# Altium schematic sheet ButtonFiltr.SchDoc
size A3
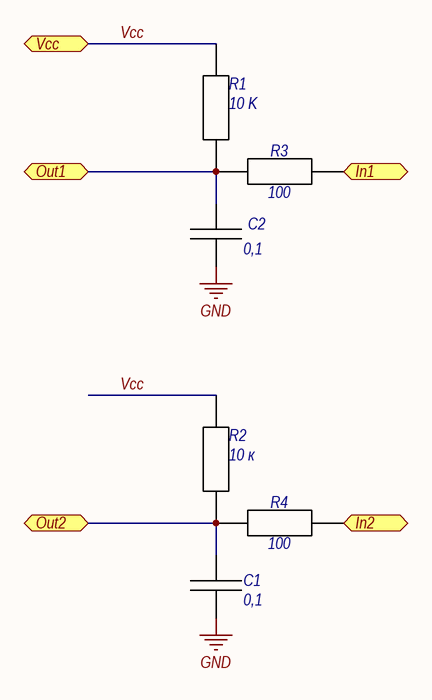
[diagram p0: ButtonFiltr.SchDoc]

## Parts
C1  Value Sch: 0,1  [C0603_autoMount]  (hidden comment: Конденсаторы керамические)
C2  Value Sch: 0,1  [C0603_autoMount]  (hidden comment: Конденсаторы керамические)
R1  Value Euro: 10 K  [R0603_autoMount]  (hidden comment: Resistor)
R2  Value Sсh: 10 к  [R0603_autoMount]  (hidden comment: Resistor)
R3  Value Sсh: 100  [R0603_autoMount]  (hidden comment: Resistor)
R4  Value Sсh: 100  [R0603_autoMount]  (hidden comment: Resistor)

## Ports
In1, In2, Out1, Out2, Vcc

## Nets
GND: C1.1 C2.1
In1: R3.1 ; port In1
In2: R4.1 ; port In2
Out1: C2.2 R1.2 R3.2 ; port Out1
Out2: C1.2 R2.2 R4.2 ; port Out2
Vcc: R1.1 R2.1 ; port Vcc

## Library data of the parts
C1 C2 = Чип. керам. 0603 0,1 мкФ 50 В +/-10% X7R CC0603KKX7R9BB104 "Yageo": Part Number Euro: 100 nF 50  V +/-10% X7R CC0603KKX7R9BB104 "Yageo"; Power/Voltage: 50 В; Voltage Euro: 50  V; TKE: X7R; Tolerance: +/-10%; Value: 0,1 мкФ; Value Euro: 100 nF; Part Number: Чип. керам. 0603 0,1 мкФ 50 В +/-10% X7R CC0603KKX7R9BB104 "Yageo"; Manufacturer: "Yageo"; ManufacturerPartNumber: CC0603KKX7R9BB104; Package: Чип конд. 0603; Price: 9; ComponentType: Чип. керам. 0603
R1 = Чип рез. 0603 10 кОм  +/-1% RC0603FR-0710KL "Yageo": Part Number Euro: RC0603FR-0710KL 10 K +/-1% "Yageo"; Tolerance: +/-1%; Value: 10 кОм; Value Sсh: 10 к; Part Number: Чип рез. 0603 10 кОм  +/-1% RC0603FR-0710KL "Yageo"; Manufacturer: "Yageo"; ManufacturerPartNumber: RC0603FR-0710KL; Package: Чип рез. 0603; ComponentType: Чип рез. 0603
R2 = Чип рез. 0603 10 кОм  +/-1% RC0603FR-0710KL "Yageo": Part Number Euro: RC0603FR-0710KL 10 K +/-1% "Yageo"; Tolerance: +/-1%; Value: 10 кОм; Value Euro: 10 K; Part Number: Чип рез. 0603 10 кОм  +/-1% RC0603FR-0710KL "Yageo"; Manufacturer: "Yageo"; ManufacturerPartNumber: RC0603FR-0710KL; Package: Чип рез. 0603; ComponentType: Чип рез. 0603
R3 R4 = Чип рез. 0603 100 Ом  +/-1% RC0603FR-07100RL "Yageo": Part Number Euro: RC0603FR-07100RL 100 R +/-1% "Yageo"; Tolerance: +/-1%; Value: 100 Ом; Value Euro: 100 R; Part Number: Чип рез. 0603 100 Ом  +/-1% RC0603FR-07100RL "Yageo"; Manufacturer: "Yageo"; ManufacturerPartNumber: RC0603FR-07100RL; Package: Чип рез. 0603; ComponentType: Чип рез. 0603